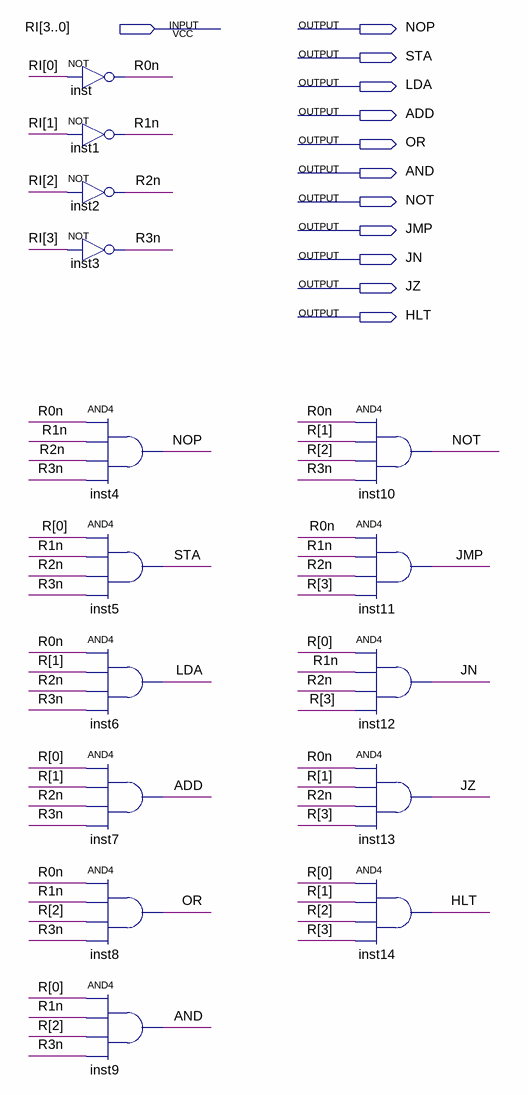
[diagram p0: schematic sheet]
// Quartus schematic decod_RI.bdf as structural Verilog: 15 symbols, 12 pins
module decod_RI (
  input  [3:0] RI,
  output NOP,
  output STA,
  output LDA,
  output ADD,
  output OR,
  output AND,
  output NOT,
  output JMP,
  output JN,
  output JZ,
  output HLT
);

  wire R0n, R1n, R2n, R3n;
  wire [3:0] R;

  not inst (R0n, RI[0]);
  not inst1 (R1n, RI[1]);
  not inst2 (R2n, RI[2]);
  not inst3 (R3n, RI[3]);
  and inst4 (NOP, R0n, R1n, R2n, R3n);
  and inst5 (STA, R[0], R1n, R2n, R3n);
  and inst6 (LDA, R0n, R[1], R2n, R3n);
  and inst7 (ADD, R[0], R[1], R2n, R3n);
  and inst8 (OR, R0n, R1n, R[2], R3n);
  and inst9 (AND, R[0], R1n, R[2], R3n);
  and inst10 (NOT, R0n, R[1], R[2], R3n);
  and inst11 (JMP, R0n, R1n, R2n, R[3]);
  and inst12 (JN, R[0], R1n, R2n, R[3]);
  and inst13 (JZ, R0n, R[1], R2n, R[3]);
  and inst14 (HLT, R[0], R[1], R[2], R[3]);
endmodule
